# Altium schematic sheet RobotCtrl_Base_Power.SchDoc
size A3; Author: Power Lin; DocumentNumber: 1; SheetNumber: 1; SheetTotal: 1; Website: wiki-power.com
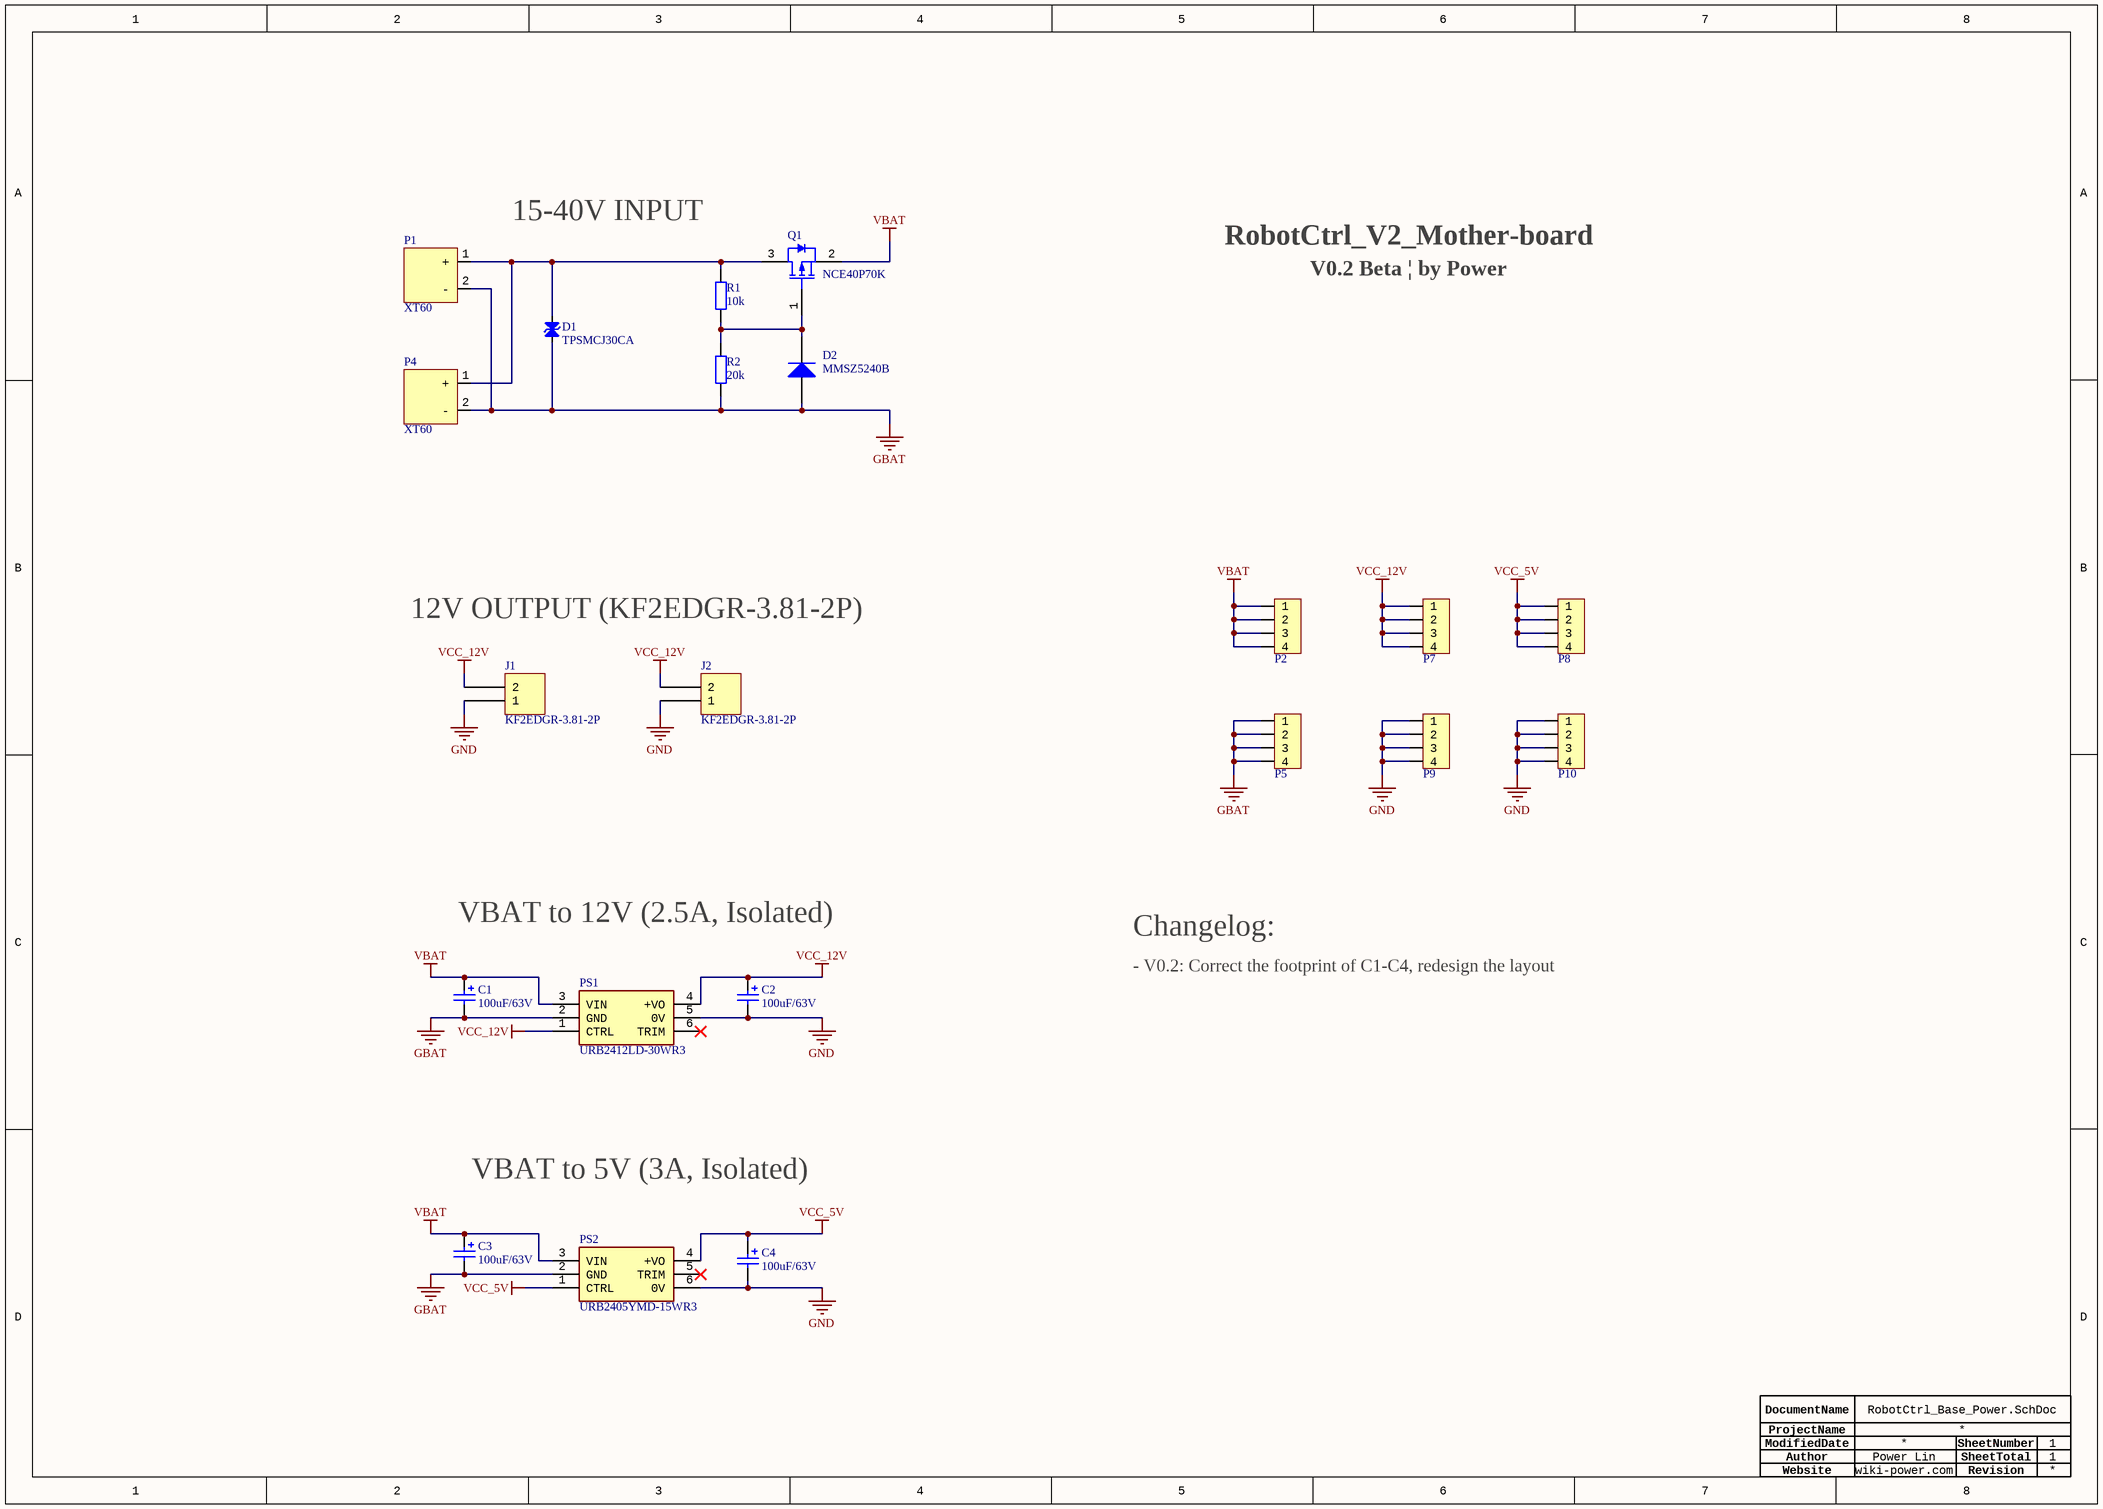
[diagram p0: RobotCtrl_Base_Power.SchDoc]

## Parts
C1  100uF/63V  [CAP 3.5*8*11.5]
C2  100uF/63V  [CAP 3.5*8*11.5]
C3  100uF/63V  [CAP 3.5*8*11.5]
C4  100uF/63V  [CAP 3.5*8*11.5]
D1  TPSMCJ30CA  [DO-214AB/SMC]
D2  MMSZ5240B  [SOD_123]
J1  KF2EDGR-3.81-2P  [FCI 06-381-2PIN]
J2  KF2EDGR-3.81-2P  [FCI 06-381-2PIN]
P1  XT60  [XT60PW-M]
P2  HDR1x4_2.54  [HDR1x4_2.54_180]  (value not drawn)
P4  XT60  [XT60PW-M]
P5  HDR1x4_2.54  [HDR1x4_2.54_180]  (value not drawn)
P7  HDR1x4_2.54  [HDR1x4_2.54_180]  (value not drawn)
P8  HDR1x4_2.54  [HDR1x4_2.54_180]  (value not drawn)
P9  HDR1x4_2.54  [HDR1x4_2.54_180]  (value not drawn)
P10  HDR1x4_2.54  [HDR1x4_2.54_180]  (value not drawn)
PS1  URB2412LD-30WR3  [URB2412LD30WR3]
PS2  URB2405YMD-15WR3  [URB2405YMD15WR3]
Q1  NCE40P70K  [TO-252]
R1  10k  [R-0603]
R2  20k  [R-0603]

## Nets
GBAT: C1.2 C3.2 D1.1 D2.1(A) P1.2(-) P4.2(-) P5.1 P5.2 P5.3 P5.4 PS1.2(GND) PS2.2(GND) R2.2
GND: C2.2 C4.2 J1.1 J2.1 P9.1 P9.2 P9.3 P9.4 P10.1 P10.2 P10.3 P10.4 PS1.5(0V) PS2.6(0V)
VBAT: C1.1 C3.1 P2.1 P2.2 P2.3 P2.4 PS1.3(VIN) PS2.3(VIN) Q1.2(SOURCE)
VCC_5V: C4.1 P8.1 P8.2 P8.3 P8.4 PS2.1(CTRL) PS2.4(+VO)
VCC_12V: C2.1 J1.2 J2.2 P7.1 P7.2 P7.3 P7.4 PS1.1(CTRL) PS1.4(+VO)
NetD1_2: D1.2 P1.1(+) P4.1(+) Q1.3(DRAIN) R1.1
NetD2_2: D2.2(K) Q1.1(GATE) R1.2 R2.1

Not connected (* = marked no-connect by the designer): PS1 6(TRIM)*; PS2 5(TRIM)*

## Notes on the sheet
- 15-40V INPUT
- RobotCtrl_V2_Mother-board
- V0.2 Beta | by Power
- 12V OUTPUT (KF2EDGR-3.81-2P)
- VBAT to 12V (2.5A, Isolated)
- Changelog:
- - V0.2: Correct the footprint of C1-C4, redesign the layout
- VBAT to 5V (3A, Isolated)
- Author
- DocumentName
- ModifiedDate
- ProjectName
- SheetNumber
- SheetTotal
- Website
- Revision

## Library data of the parts
C1-C4 = CAP-POL: ECR1JBK101MLL080011 / https://list.szlcsc.com/catalog/312.html?%26%7C%7C%3D%7B%22param_13003_n%22%3A%5B%22100uF%22%5D%2C%22param_13005_n%22%3A%5B%22range-60V~%22%5D%2C%22queryProductStandard%22%3A%5B%22%E5%BE%84%E5%90%91%E5%BC%95%E7%BA%BF%2C8x11.5mm%22%5D%7D%7C%7C; ComponentLink1Description: 供应商链接; ComponentLink1URL: http://www.szlcsc.com/product/details_16815.html; Package: 3528; Supplier: LC; SuppliersPartNumber: C16133
D1 = TVS_C
D2 = DIODE: 稳压 10V; ComponentLink1Description: 供应商链接; ComponentLink1URL: http://www.szlcsc.com/product/details_23178.html; Package: SMA(DO-214AC); Supplier: LC; SuppliersPartNumber: C22452
J1 J2 = KF2EDGR-3.81-2P: TERM BLOCK HDR 2POS 90DEG 3.81MM; Part Number: OQ0232510000G; Manufacturer: Amphenol Anytek; Manufacturer: Amphenol; Number of Levels: 1; Number of Positions: 2; Header Orientation: 90°, Right Angle; Current - UL: 10A; Pitch: 0.150" (3.81mm); Voltage - UL: 300V; Lifecycle Status: 0; ComponentLink1Description: Datasheet; Series: 06-381; Color: Green; Termination Style: Solder; Minimum Order: 1; Type: Header, Male Pins, Shrouded (4 Side); LastUpdated: 2019-12-16 19:14:30.110; Operating Temperature: -40°C ~ 115°C; Packaging: Bulk; ComponentLink1URL: http://portal.fciconnect.com/Comergent//fci/drawing/oqxx32x100j0g.pdf; Price: 0.49; Mounting Type: Through Hole; Positions Per Level: 2; Contact Mating Finish: Tin; Part Status: Active; Manufacturer Part Number: OQ0232510000G; Component Type: 接线端子
P1 P4 = XT30/60
P2 P5 = HDR1x4_2.54: Header
P7-P10 = HDR1x4_2.54: Header; System: Connector
PS1 = URB2412LD-30WR3: 金升阳隔离电源; Manufacturer_Name: Mornsun; Manufacturer_Part_Number: URB2412LD-30WHR3; Datasheet Link: https://4donline.ihs.com/images/VipMasterIC/IC/MNSN/MNSN-S-A0002273855/MNSN-S-A0002273855-1.pdf?hkey=EF798316E3902B6ED9A73243A3159BB0; Height: 16.8mm
PS2 = URB2405YMD-15WR3: 金升阳隔离电源; Manufacturer_Name: Mornsun; Manufacturer_Part_Number: URB2405YMD-10WR3; Datasheet Link: https://www.mornsun-power.com/html/pdf/URB2405YMD-10WR3.html; Height: 12.2mm
Q1 = P-MOS: Manufacturer: NCE Power; Mounting Technology: SM; Package Reference: SOT23-3; Case/Package: SOT23-3; Package Description: 3-Pin Small Outline Transistor, Body 2.9 x 1.3 mm, Pitch 0.95 mm; Datasheet Version: Rev. 1.1, 07/2014; RoHS Compliant: Unknown; Datasheet URL: http://www.ncepower.com/Upload/MOSFET/mos1/55vpmos/NCE3407Adatasheet-17275285683.pdf; Component Type: Transistors
R1 R2 = RES: 贴片电阻; Package: 0805; Supplier: LC; SuppliersPartNumber: C17798